# Altium schematic sheet main.SchDoc
size A4
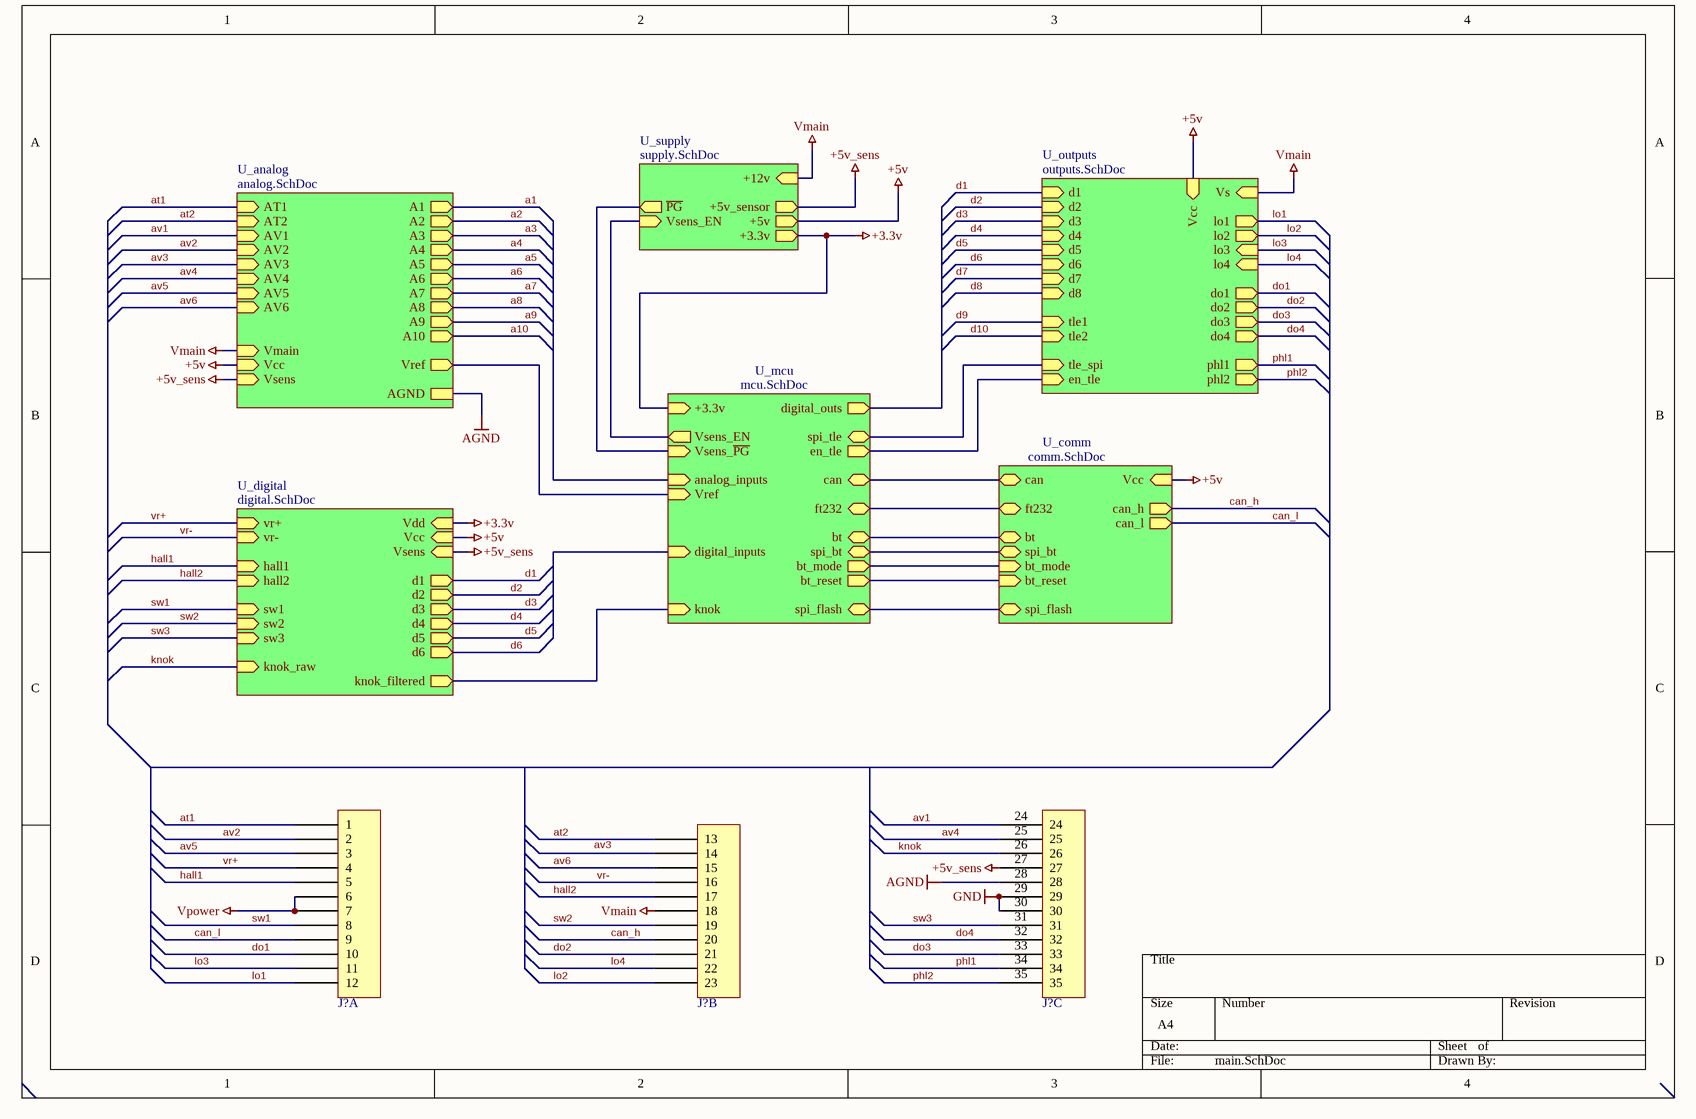
[diagram p0: main.SchDoc]

## Parts
(Parts that share a designator on the sheet are numbered #1, #2 ... from top to bottom, then left to right.)
J?#1  Conn_TE_1-776163-1_eec  [TE_1-776163-1_0]  (value not drawn)  (part A of 3)
J?#2  Conn_TE_1-776163-1_eec  [TE_1-776163-1_0]  (value not drawn)  (part B of 3)
J?#3  Conn_TE_1-776163-1_eec  [TE_1-776163-1_0]  (value not drawn)  (part C of 3)

## Sub-sheets
U_analog = analog.SchDoc: AT1 (in), AT2 (in), AV1 (in), AV2 (in), AV3 (in), AV4 (in), AV5 (in), AV6 (in), A1 (out), A2 (out), A3 (out), A4 (out), A5 (out), A6 (out), A7 (out), A8 (out), A9 (out), A10 (out), Vmain (in), Vcc (in), Vsens (in), AGND, Vref (out)
U_comm = comm.SchDoc: can (bidir), bt (bidir), ft232 (bidir), spi_flash (bidir), spi_bt (bidir), can_h (out), can_l (out), Vcc (in), bt_mode (in), bt_reset (in)
U_digital = digital.SchDoc: hall1 (in), hall2 (in), sw1 (in), sw2 (in), knok_raw (in), vr+ (in), vr- (in), d1 (out), d2 (out), d3 (out), d4 (out), knok_filtered (out), d6 (out), sw3 (in), d5 (out), Vdd (in), Vcc (in), Vsens (in)
U_mcu = mcu.SchDoc: analog_inputs (in), digital_outs (out), +3.3v (in), Vsens_EN (out), Vsens_~{PG} (in), digital_inputs (in), knok (in), can (bidir), bt (bidir), ft232 (bidir), spi_tle (bidir), spi_flash (bidir), spi_bt (bidir), en_tle (out), bt_mode (out), bt_reset (out), Vref (in)
U_outputs = outputs.SchDoc: lo1 (out), lo2 (out), do1 (out), do2 (out), do3 (out), do4 (out), phl1 (out), phl2 (out), tle1 (in), tle2 (in), tle_spi (in), Vs (in), d1 (in), d2 (in), d3 (in), d4 (in), d5 (in), d6 (in), d7 (in), d8 (in), lo3 (in), lo4 (in), en_tle (in), Vcc (in)
U_supply = supply.SchDoc: +12v (in), +5v (out), +5v_sensor (out), +3.3v (out), ~{PG} (out), Vsens_EN (in)

## Nets
+3.3v: sheet U_digital/Vdd, sheet U_supply/+3.3v, sheet U_mcu/+3.3v
+5v: sheet U_analog/Vcc, sheet U_digital/Vcc, sheet U_outputs/Vcc, sheet U_comm/Vcc, sheet U_supply/+5v
+5v_sens: J?#3.27 ; sheet U_analog/Vsens, sheet U_digital/Vsens, sheet U_supply/+5v_sensor
AGND: J?#3.28 ; sheet U_analog/AGND
GND: J?#3.29 J?#3.30
Vmain: J?#2.18 ; sheet U_analog/Vmain, sheet U_outputs/Vs, sheet U_supply/+12v
Vpower: J?#1.6 J?#1.7
a1: sheet U_analog/A1
a2: sheet U_analog/A2
a3: sheet U_analog/A3
a4: sheet U_analog/A4
a5: sheet U_analog/A5
a6: sheet U_analog/A6
a7: sheet U_analog/A7
a8: sheet U_analog/A8
a9: sheet U_analog/A9
a10: sheet U_analog/A10
at1: J?#1.1 ; sheet U_analog/AT1
at2: J?#2.13 ; sheet U_analog/AT2
av1: J?#3.24 ; sheet U_analog/AV1
av2: J?#1.2 ; sheet U_analog/AV2
av3: sheet U_analog/AV3
av4: J?#3.25 ; sheet U_analog/AV4
av5: J?#1.3 ; sheet U_analog/AV5
av6: J?#2.15 ; sheet U_analog/AV6
can_h: J?#2.20 ; sheet U_comm/can_h
can_l: J?#1.9 ; sheet U_comm/can_l
d1: sheet U_digital/d1, sheet U_outputs/d1
d2: sheet U_digital/d2, sheet U_outputs/d2
d3: sheet U_digital/d3, sheet U_outputs/d3
d4: sheet U_digital/d4, sheet U_outputs/d4
d5: sheet U_digital/d5, sheet U_outputs/d5
d6: sheet U_digital/d6, sheet U_outputs/d6
d7: sheet U_outputs/d7
d8: sheet U_outputs/d8
d9: sheet U_outputs/tle1
d10: sheet U_outputs/tle2
do1: J?#1.10 ; sheet U_outputs/do1
do2: J?#2.21 ; sheet U_outputs/do2
do3: J?#3.33 ; sheet U_outputs/do3
do4: J?#3.32 ; sheet U_outputs/do4
hall1: J?#1.5 ; sheet U_digital/hall1
hall2: J?#2.17 ; sheet U_digital/hall2
knok: J?#3.26 ; sheet U_digital/knok_raw
lo1: J?#1.12 ; sheet U_outputs/lo1
lo2: J?#2.23 ; sheet U_outputs/lo2
lo3: J?#1.11 ; sheet U_outputs/lo3
lo4: J?#2.22 ; sheet U_outputs/lo4
phl1: J?#3.34 ; sheet U_outputs/phl1
phl2: J?#3.35 ; sheet U_outputs/phl2
sw1: J?#1.8 ; sheet U_digital/sw1
sw2: J?#2.19 ; sheet U_digital/sw2
sw3: J?#3.31 ; sheet U_digital/sw3
vr+: J?#1.4 ; sheet U_digital/vr+
vr-: J?#2.16 ; sheet U_digital/vr-
(unnamed): sheet U_analog/Vref, sheet U_mcu/Vref
(unnamed): sheet U_digital/knok_filtered, sheet U_mcu/knok
(unnamed): sheet U_outputs/en_tle, sheet U_mcu/en_tle
(unnamed): sheet U_comm/bt_mode, sheet U_mcu/bt_mode
(unnamed): sheet U_comm/bt_reset, sheet U_mcu/bt_reset
(unnamed): sheet U_supply/~{PG}, sheet U_mcu/Vsens_~{PG}
(unnamed): sheet U_supply/Vsens_EN, sheet U_mcu/Vsens_EN

Not connected (* = marked no-connect by the designer): J?#2 14

## Buses and harness runs
bus sheet U_comm/bt = sheet U_mcu/bt
bus sheet U_comm/can = sheet U_mcu/can
bus sheet U_comm/ft232 = sheet U_mcu/ft232
bus sheet U_comm/spi_bt = sheet U_mcu/spi_bt
bus sheet U_comm/spi_flash = sheet U_mcu/spi_flash
bus sheet U_mcu/spi_tle = sheet U_outputs/tle_spi

## Notes on the sheet
- Labels drawn without touching a wire or pin: av3

## Library data of the parts
J?#1-J?#3 = Conn_TE_1-776163-1_eec: CONN 35 Positions Header, Shrouded Connector 0.157" (4.00mm) Panel Mount, Through Hole, Right Angle Gold-Palladium; Manufacturer: TE; helpURL: https://upverter.com/upn/revision/16af53c132ac2fb1/; ComponentLink2Description: Datasheet; Temperature: to; Package: CONN_PTH_76MM9_18MM6; Supplier 2: Mouser; Price: 11.0652877997; Supplier 1: Digi-Key; ComponentLink1URL: https://upverter.com/upn/revision/16af53c132ac2fb1/; Supplier Part Number 2: 571-1-776163-1; Supplier Part Number 1: A106383-ND; ComponentLink1Description: Upverter; ComponentLink2URL: http://www.mouser.com/ds/2/418/NG_CD_776163_J8-683122.pdf; RoHS: TRUE; Mouser Part Number: 571-1-776163-1; Digikey Description: CONN 35 Positions Header, Shrouded Connector 0.157" (4.00mm) Panel Mount, Through Hole, Right Angle Gold-Palladium; Digikey Part Number: A106383-ND; Lead Free: yes